# EAGLE design led_driver_12v_1a_round (EAGLE 7.5.0)
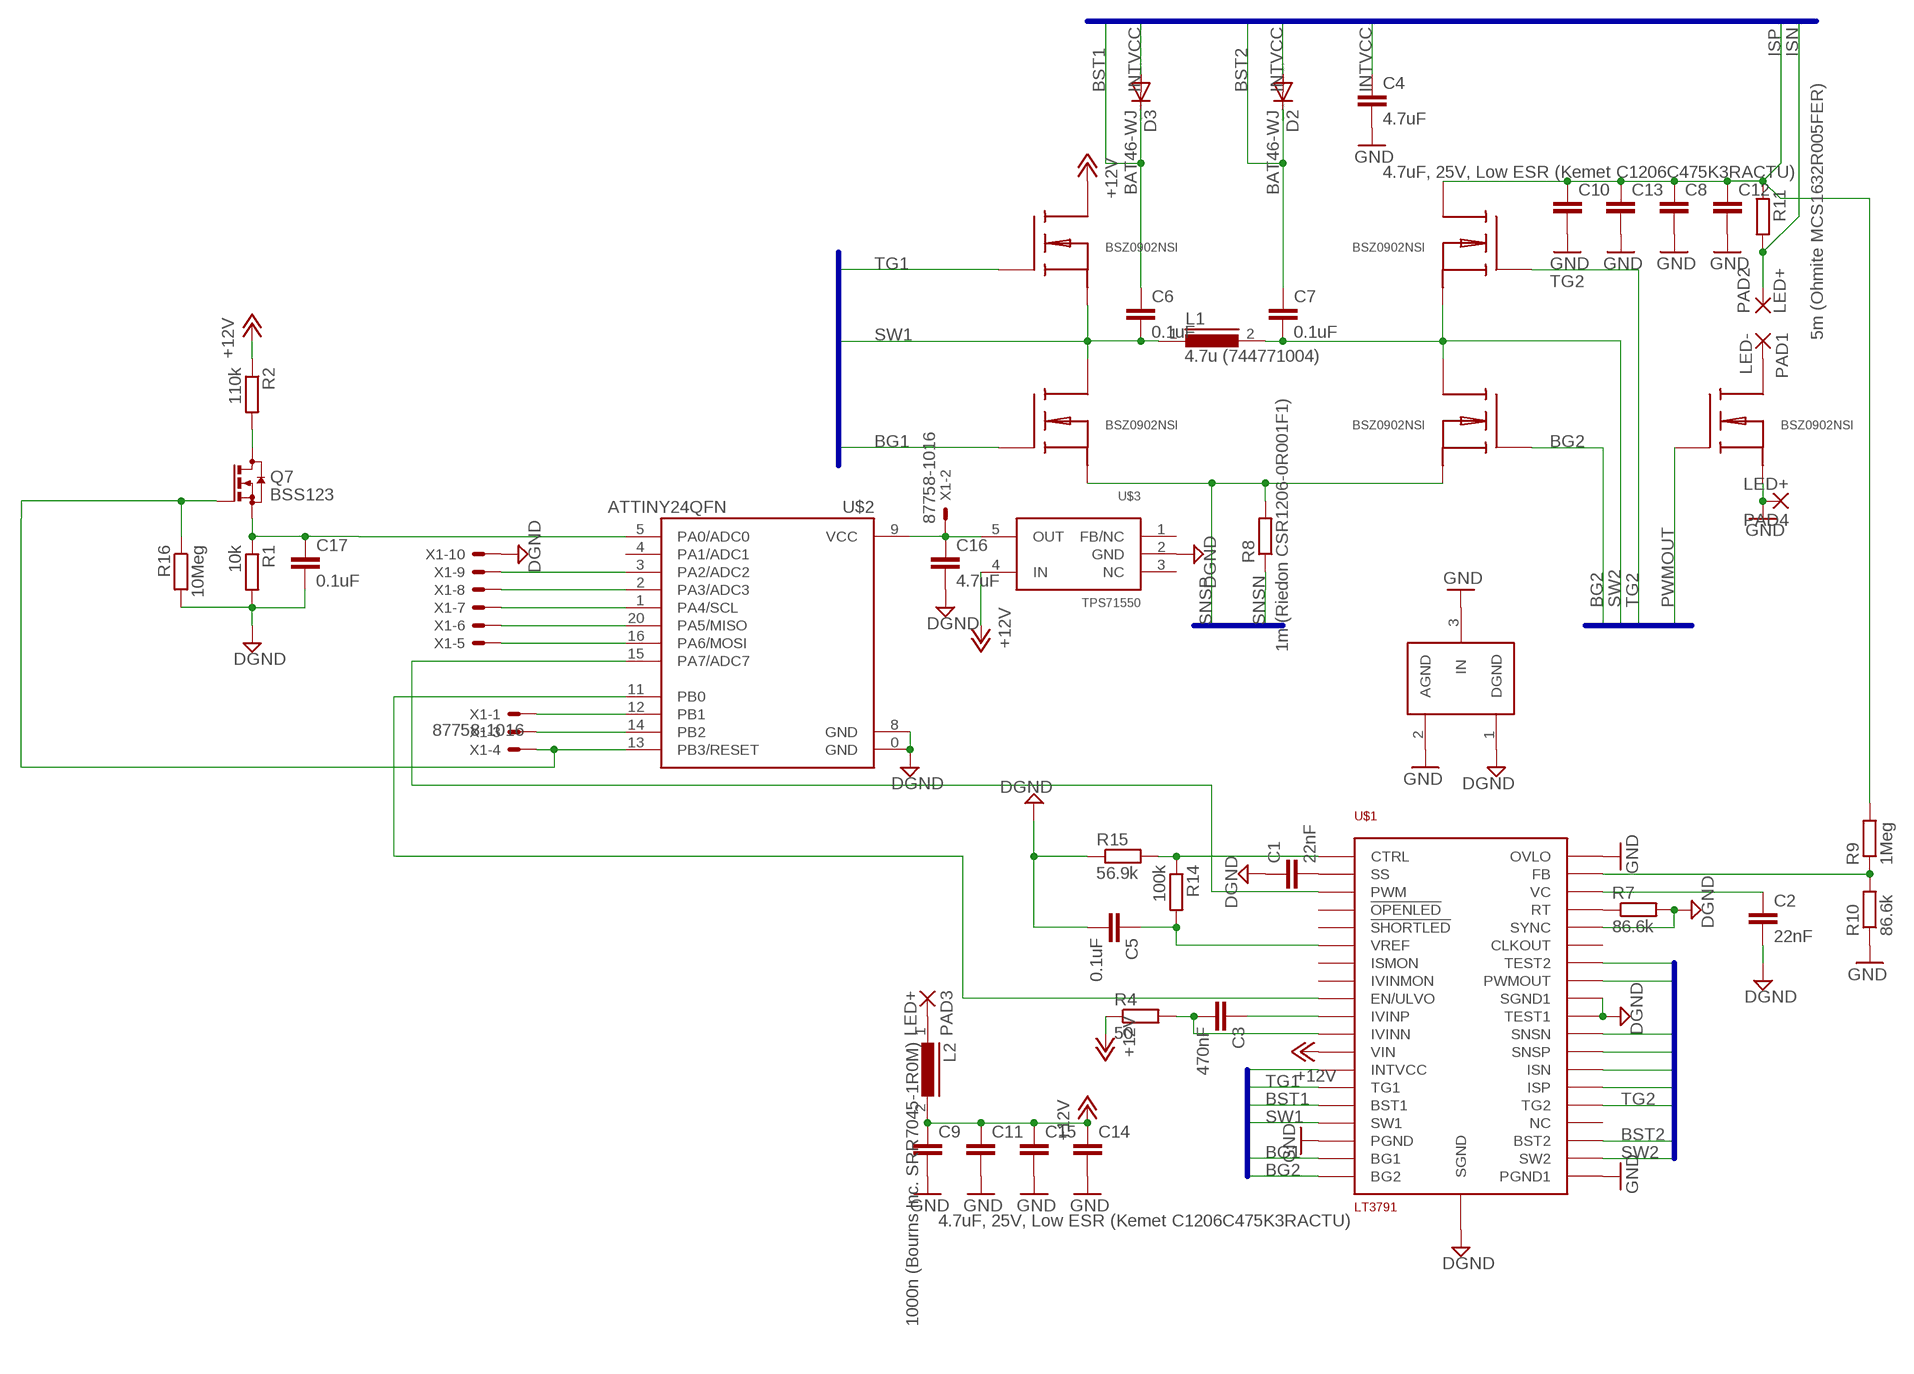
[diagram p0: schematic, sheet 1]

## Parts
C1  22nF  C-EUC0402  [C0402]
C2  22nF  C-EUC0402K  [C0402K]
C3  470nF  C-EUC0402K  [C0402K]
C4  4.7uF  C-EUC1206  [C1206]
C5  0.1uF  C-EUC0402K  [C0402K]
C6  0.1uF  C-EUC0402K  [C0402K]
C7  0.1uF  C-EUC0402K  [C0402K]
C8  4.7uF, 25V, Low ESR (Kemet C1206C475K3RACTU)  C-EUC1206  [C1206]
C9  4.7uF, 25V, Low ESR (Kemet C1206C475K3RACTU)  C-EUC1206  [C1206]
C10  4.7uF, 25V, Low ESR (Kemet C1206C475K3RACTU)  C-EUC1206  [C1206]
C11  4.7uF, 25V, Low ESR (Kemet C1206C475K3RACTU)  C-EUC1206  [C1206]
C12  4.7uF, 25V, Low ESR (Kemet C1206C475K3RACTU)  C-EUC1206  [C1206]
C13  4.7uF, 25V, Low ESR (Kemet C1206C475K3RACTU)  C-EUC1206  [C1206]
C14  4.7uF, 25V, Low ESR (Kemet C1206C475K3RACTU)  C-EUC1206  [C1206]
C15  4.7uF, 25V, Low ESR (Kemet C1206C475K3RACTU)  C-EUC1206  [C1206]
C16  4.7uF  C-EUC1206  [C1206]
C17  0.1uF  C-EUC0402K  [C0402K]
D2  BAT46-WJ  DIODE-SOD323-W  [SOD323-W]
D3  BAT46-WJ  DIODE-SOD323-W  [SOD323-W]
L1  4.7u (744771004)  DR127  [DR127]
L2  1000n (Bourns Inc. SRR7045-1R0M)  DR74  [DR74]
PAD1  LED-  WIREPAD3,81/1,4  [3,81/1,4]
PAD2  LED+  WIREPAD3,81/1,4  [3,81/1,4]
PAD3  LED+  WIREPADSMD5-2,5  [5-2,5]
PAD4  LED+  WIREPADSMD5-2,5  [5-2,5]
Q1  BSZ0902NSI  BSZ090X  [BSZ090X]
Q2  BSZ0902NSI  BSZ090X  [BSZ090X]
Q3  BSZ0902NSI  BSZ090X  [BSZ090X]
Q4  BSZ0902NSI  BSZ090X  [BSZ090X]
Q5  BSZ0902NSI  BSZ090X  [BSZ090X]
Q7  BSS123  [SOT23]
R1  10k  R-EU_R0402  [R0402]
R2  110k  R-EU_R0402  [R0402]
R4  50  R-EU_R0402  [R0402]
R7  86.6k  R-EU_R0402  [R0402]
R8  1m (Riedon CSR1206-0R001F1)  R-EU_R1206  [R1206]
R9  1Meg  R-EU_R0402  [R0402]
R10  86.6k  R-EU_R0402  [R0402]
R11  5m (Ohmite MCS1632R005FER)  R-EU_R1206  [R1206]
R14  100k  R-EU_R0402  [R0402]
R15  56.9k  R-EU_R0402  [R0402]
R16  10Meg  R-EU_R0402  [R0402]
U$1  LT3791  [TSSOP38]
U$2  ATTINY24QFN  [QFN20]
U$3  TPS71550  TPS715  [SC70]
U$4  GND_CONNECT  [GND_CONNECT]
X1  87758-1016  [87758-1016]

## Nets
+12V: C9.1 C11.1 C14.1 C15.1 L2.2 Q1.D Q1.D@1(D) Q1.D@2(D) Q1.D@3(D) Q1.D@4(D) R2.1 R4.1 U$1.P$12(VIN) U$3.4(IN)
BG1 [HI_PWR]: Q2.G U$1.P$18(BG1)
BG2 [HI_PWR]: Q3.G U$1.P$19(BG2)
BST1 [HI_PWR]: C6.1 D3.C U$1.P$15(BST1)
BST2 [HI_PWR]: C7.1 D2.C U$1.P$22(BST2)
DGND: C1.1 C2.2 C5.2 C16.2 C17.2 R1.2 R7.2 R15.1 R16.2 U$1.P$29(TEST1) U$1.P$30(SGND) U$1.P$34(SYNC) U$1.P$39(SGND1) U$2.0(GND) U$2.8(GND) U$3.2(GND) U$4.1(DGND) X1.10
GND [HI_PWR]: C4.2 C8.2 C9.2 C10.2 C11.2 C12.2 C13.2 C14.2 C15.2 PAD4.1(P) Q5.S@1(S) Q5.S@2(S) Q5.S@3(S) Q5.S@4(S) R10.1 U$1.P$17(PGND) U$1.P$20(PGND1) U$1.P$38(OVLO) U$4.2(AGND) U$4.3(IN)
INTVCC [HI_PWR]: C4.1 D2.A D3.A U$1.P$13(INTVCC) U$1.P$32(TEST2)
ISN: PAD2.1(P) R11.2 U$1.P$26(ISN)
ISP: C8.1 C10.1 C12.1 C13.1 Q4.D Q4.D@1(D) Q4.D@2(D) Q4.D@3(D) Q4.D@4(D) R9.2 R11.1 U$1.P$25(ISP)
MISO: U$2.20(PA5/MISO) X1.6
MOSI: U$2.16(PA6/MOSI) X1.5
N$1: C5.1 R14.2 U$1.P$6(VREF)
N$2: R14.1 R15.2 U$1.P$1(CTRL)
N$3: R7.1 U$1.P$35(RT)
N$4: C1.2 U$1.P$2(SS)
N$5: C2.1 U$1.P$36(VC)
N$6: R9.1 R10.2 U$1.P$37(FB)
N$7: C3.1 U$1.P$10(IVINP)
N$8: Q7.3(D) R2.2
N$9: C3.2 R4.2 U$1.P$11(IVINN)
N$10: U$1.P$9(EN/ULVO) U$2.11(PB0)
N$12: C16.1 U$2.9(VCC) U$3.5(OUT) X1.2
N$14: U$1.P$3(PWM) U$2.15(PA7/ADC7)
N$15: C17.1 Q7.2(S) R1.1 U$2.5(PA0/ADC0)
N$19: PAD1.1(P) Q5.D Q5.D@1(D) Q5.D@2(D) Q5.D@3(D) Q5.D@4(D)
N$21: L2.1 PAD3.1(P)
PA2: U$2.3(PA2/ADC2) X1.9
PA3: U$2.2(PA3/ADC3) X1.8
PB1: U$2.12(PB1) X1.1
PB2: U$2.14(PB2) X1.3
PWMOUT [HI_PWR]: Q5.G U$1.P$31(PWMOUT)
RESET: Q7.1(G) R16.1 U$2.13(PB3/RESET) X1.4
SCL: U$2.1(PA4/SCL) X1.7
SNSN: R8.1 U$1.P$28(SNSN)
SNSP: Q2.S@1(S) Q2.S@2(S) Q2.S@3(S) Q2.S@4(S) Q3.S@1(S) Q3.S@2(S) Q3.S@3(S) Q3.S@4(S) R8.2 U$1.P$27(SNSP)
SW1 [HI_PWR]: C6.2 L1.1 Q1.S@1(S) Q1.S@2(S) Q1.S@3(S) Q1.S@4(S) Q2.D Q2.D@1(D) Q2.D@2(D) Q2.D@3(D) Q2.D@4(D) U$1.P$16(SW1)
SW2 [HI_PWR]: C7.2 L1.2 Q3.D Q3.D@1(D) Q3.D@2(D) Q3.D@3(D) Q3.D@4(D) Q4.S@1(S) Q4.S@2(S) Q4.S@3(S) Q4.S@4(S) U$1.P$21(SW2)
TG1 [HI_PWR]: Q1.G U$1.P$14(TG1)
TG2 [HI_PWR]: Q4.G U$1.P$24(TG2)
Unconnected: U$1.P$4(!OPENLED) U$1.P$5(!SHORTLED) U$1.P$7(ISMON) U$1.P$8(IVINMON) U$1.P$23(NC) U$1.P$33(CLKOUT) U$2.4(PA1/ADC1) U$3.1(FB/NC) U$3.3(NC)

## Buses
BG1,BG2,SW1,SW2,TG1,TG2,BST1,BST2,INTVCC
BG1,BG2,SW1,SW2,TG1,TG2,BST1,BST2,INTVCC,PWMOUT,SNSP,SNSN,ISN,ISP

## Library data of the parts
C1-C3 C5-C7 C17 = resistor:C-EU: CAPACITOR, European symbol
C4 C8-C16 = rcl:C-EU: CAPACITOR, European symbol
D2 D3 = diode:DIODE-: DIODE
L1 = inductors:DR127: High Power Density, High Efficiency, Shielded Inductors Source: coiltronics_dr_series.pdf
L2 = inductors:DR74: High Power Density, High Efficiency, Shielded Inductors Source: coiltronics_dr_series.pdf
PAD1-PAD4 = wirepad:WIREPAD: Wire PAD connect wire on PCB
Q1-Q5 = vsd_custom:BSZ090X
Q7 = transistor-small-signal:BSS123: N-CHANNEL MOS FET
R1 R2 R4 R7-R11 R14-R16 = resistor:R-EU_: RESISTOR, European symbol
U$1 = ltc3791:LT3791
U$2 = SparkFun-DigitalIC:ATTINY24: Atmel 20-pin 2kB flash uC
U$3 = TPS715:TPS715
U$4 = SparkFun-Passives:GND_CONNECT: Use to make a connection of multiple grounds in only one place.
X1 = con-molex:87758-1016: 10 Pin - 2mm Dual Row Single Wafer, Vertical T/H HDR Source: http://www.molex.com/pdm_docs/sd/877580616_sd.pdf; MF: MOLEX; MPN: 87758-1016; OC_FARNELL: 7472340; OC_NEWARK: 59J1558

## Net classes
0 default: width 0.152 mm, clearance 0.152 mm
1 HI_PWR: width 0.3 mm, drill 0.4 mm, clearance 0.15 mm

## Board
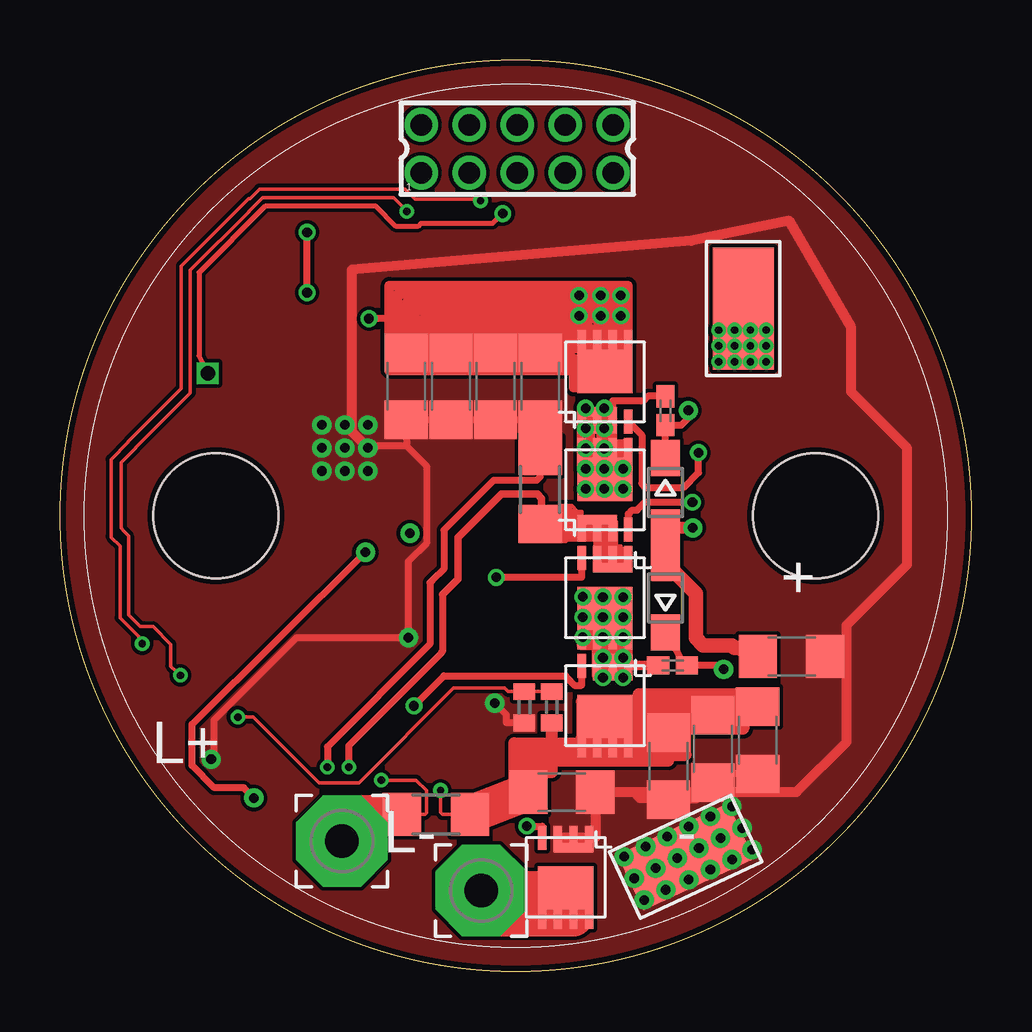
[diagram p1: board, top side]
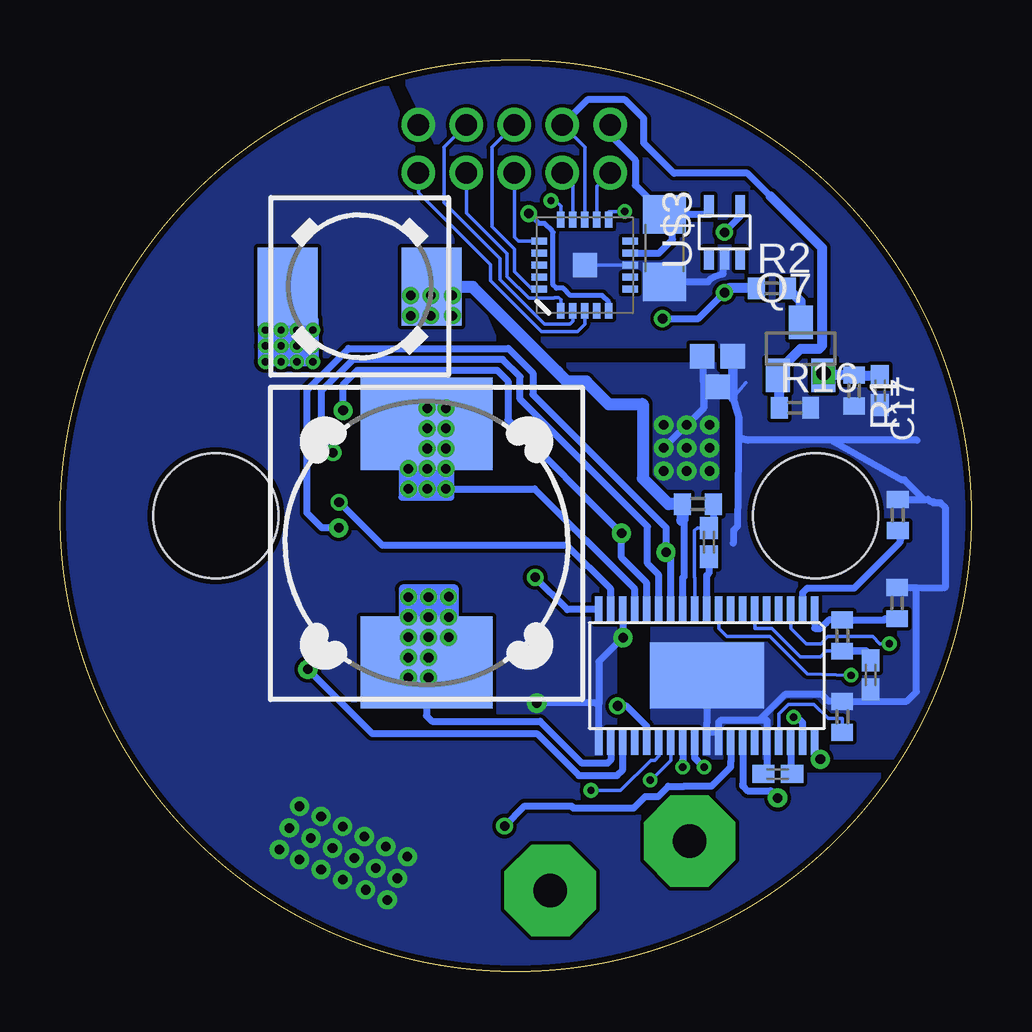
[diagram p2: board, bottom side, seen from below]

Size 38 x 38 mm. Coordinates in mm from the lower left corner, seen from the top.
Outline: circle at 19,19 radius 19
Copper layers (1*16): Top 0.035mm / dielectric 1.5mm / Bottom 0.035mm
Design rules "SeeedStudio_2layer_DRU_no_angle_20140221": minimum track width 6mil, minimum drill 12mil, track to track 6mil, track to pad 6mil, pad to pad 6mil, via to via 6mil, smd to smd 0mil, copper to edge 10mil, drill to drill 10mil, minimum pad ring 10mil, minimum via ring 6mil, stop-mask expansion 2mil, vias tented up to drill 100mil, thermal gap 10mil
Holes 5.2 mm at 31.5,19 6.5,19

### Footprints (pad centres in the part's own frame; a part is rotated, then mirrored left to right if it is on the bottom)
C0402 = smd 0.7 x 0.9: 1 -0.65,0; 2 0.65,0
C0402K = smd 0.925 x 0.74: 1 -0.6,0; 2 0.6,0
C1206 = smd 1.6 x 1.8: 1 -1.4,0; 2 1.4,0
SOD323-W = smd 1.5 x 1.2: A 1.45,0; C -1.45,0
DR127 = smd 3.85 x 5.5: 1 -4.975,0; 2 4.975,0
DR74 = smd 2.5 x 3.25: 1 -3,0; 2 3,0
3,81/1,4 = drill 1.397 pad 3.81 octagon: 1 0,0
5-2,5 = smd 2.54 x 5.08: 1 0,0
BSZ090X = smd 1.8 x 2.3: D 0.44,0 | smd 1 x 0.35: D@1 1.65,-0.975; D@2 1.65,-0.325; D@3 1.65,0.325; D@4 1.65,0.975; G -1.65,-0.975; S@2 -1.65,-0.325; S@3 -1.65,0.325; S@4 -1.65,0.975 | smd 0.4 x 1.65: S@1 -1.25,0.325
SOT23 = smd 1 x 1.4: 1 -0.95,-1.1; 2 0.95,-1.1; 3 0,1.1
R0402 = smd 0.7 x 0.9: 1 -0.65,0; 2 0.65,0
R1206 = smd 1.6 x 1.803: 1 -1.422,0; 2 1.422,0
TSSOP38 = smd 1.1 x 0.315: P$1 -2.75,4.5; P$2 -2.75,4; P$3 -2.75,3.5; P$4 -2.75,3; P$5 -2.75,2.5; P$6 -2.75,2; P$7 -2.75,1.5; P$8 -2.75,1; P$9 -2.75,0.5; P$10 -2.75,0; P$11 -2.75,-0.5; P$12 -2.75,-1; P$13 -2.75,-1.5; P$14 -2.75,-2; P$15 -2.75,-2.5; P$16 -2.75,-3; P$17 -2.75,-3.5; P$18 -2.75,-4; P$19 -2.75,-4.5; P$20 2.75,-4.5; P$21 2.75,-4; P$22 2.75,-3.5; P$23 2.75,-3; P$24 2.75,-2.5; P$25 2.75,-2; P$26 2.75,-1.5; P$27 2.75,-1; P$28 2.75,-0.5; P$29 2.75,0; P$30 2.75,0.5; P$31 2.75,1; P$32 2.75,1.5; P$33 2.75,2; P$34 2.75,2.5; P$35 2.75,3; P$36 2.75,3.5; P$37 2.75,4; P$38 2.75,4.5 | smd 2.75 x 4.75: P$39 0,0
QFN20 = smd 1 x 1: 0 0,0 | smd 0.65 x 0.3: 1 -1.9,1; 2 -1.9,0.5; 3 -1.9,0; 4 -1.9,-0.5; 5 -1.9,-1; 11 1.9,-1; 12 1.9,-0.5; 13 1.9,0; 14 1.9,0.5; 15 1.9,1 | smd 0.3 x 0.65: 6 -1,-1.9; 7 -0.5,-1.9; 8 0,-1.9; 9 0.5,-1.9; 10 1,-1.9; 16 1,1.9; 17 0.5,1.9; 18 0,1.9; 19 -0.5,1.9; 20 -1,1.9
SC70 = smd 0.9 x 0.4: 1 -1.1,0.65; 2 -1.1,0; 3 -1.1,-0.65; 4 1.1,-0.65; 5 1.1,0.65
GND_CONNECT = smd 1.016 x 1.016: 1 -1.016,0; 2 -1.016,-1.27; 3 0.254,-0.635
87758-1016 = drill 0.9 pad 1.27: 1 -4,-1; 2 -4,1; 3 -2,-1; 4 -2,1; 5 0,-1; 6 0,1; 7 2,-1; 8 2,1; 9 4,-1; 10 4,1

### Placement (x,y rotation side)
C1  3.08,19.03 270 bottom
C2  8.08,8.23 180 bottom
C3  10.95,17.89 90 bottom
C4  30.5,13.13 0 top
C5  4.21,12.37 270 bottom
C6  25.24,23.38 90 top
C7  25.54,12.76 180 top
C8  25.36,8.56 270 top
C9  14.44,24.4 270 top
C10  29.08,9.64 270 top
C11  16.3,24.4 270 top
C12  20.92,7.48 0 top
C13  27.22,9.28 270 top
C14  20.02,24.4 270 top
C15  18.16,24.4 270 top
C16  12.8,30.16 270 bottom
C17  3.82,24.22 270 bottom
D2  25.24,15.58 90 top
D3  25.24,19.96 270 top
L1  22.72,17.86 270 bottom
L2  25.51,28.56 0 bottom
PAD1  17.55,3.38 0 top
PAD2  11.76,5.44 0 top
PAD3  28.48,27.64 0 top
PAD4  26.08,4.78 115 top
Q1  22.72,24.58 90 top
Q2  22.72,20.08 90 top
Q3  22.72,15.58 270 top
Q4  22.72,11.08 270 top
Q5  21.08,3.92 270 top
Q7  7.12,25.96 0 bottom
R1  4.9,24.22 270 bottom
R2  8.32,28.48 0 bottom
R4  11.4,19.48 0 bottom
R7  5.39,10.62 90 bottom
R8  20.02,20.08 270 top
R9  20.5,11.02 270 top
R10  19.36,11.02 90 top
R11  15.67,6.55 180 top
R14  5.39,14.01 270 bottom
R15  3.1,15.36 270 bottom
R16  7.36,23.5 0 bottom
U$1  11.04,12.34 270 bottom
U$2  16.12,29.45 90 bottom
U$3  10.3,30.82 90 bottom
U$4  9.96,24.62 270 bottom
X1  19.06,34.3 0 top

### Tracks (layer width: path | path; a pad name or v marks a point on that pad's centre or on a via)
+12V  (via drill 0.4, 0.4 pad 0.61)
  Top 0.152: 22.76,25.5 23.05,25.5 Q1.D@2 23.05,26.59 | 22.39,25.87 22.76,25.5 | Q1.D 22.76,25.06 22.76,25.5 | 21.75,25.87 21.75,25.5 | Q1.D@4 21.75,25.87 | 21.75,25.87 22.39,25.87 | Q1.D@3 22.39,25.87 | C11.1 C9.1
  Top 0.3: 13.72,28.6 13.72,27.22 v12.88,27.22 | v10.3,28.3 v10.3,30.82
  Top 0.4: C14.1 21.15,25.8 21.45,25.5 21.75,25.5 | 23.05,26.59 23.33,26.59 21.94,26.74 21.94,26.5 15.4,26.5 15.4,26.86 22.06,26.86 22.06,26.26 15.16,26.26 15.16,27.22 22.42,27.22 22.42,27.04 | 22.42,27.04 22.42,25.96 14.8,25.96 14.8,27.58 22.72,27.58 22.72,25.54 14.44,25.54 14.44,27.88 23.08,27.88 | 23.08,27.88 23.08,25.18 14.08,25.18 14.08,28.24 23.38,28.24 | 23.38,28.24 v23.38,28.18 | v23.38,28.18 v23.38,27.34 | v23.38,27.34 23.38,24.34 21.4,24.34 21.4,25.06 13.72,25.06 13.72,27.22 13.72,28.6 23.68,28.6 23.68,26.23 Q1.D@1 | 23.38,28.24 v23.38,28.18 | 23.08,27.88 v23.38,27.34 | v22.54,27.34 22.42,27.04
  Top 0.406: C14.1 C15.1 C11.1 19.86,25.8 v21.64,27.34
  Bottom 0.3: 12.05,18.81 11.99,18.74 11.99,16.46 12.04,16.41 U$1.P$12 | U$3.4 9.65,31.47 v10.3,30.82 | v12.88,27.22 11.38,27.22 v10.3,28.3
  Bottom 0.4: 21.46,28.48 v21.64,28.18 | L2.2 v22.54,28.18
  Bottom 0.406: L2.2 22.48,28.54 21.52,28.54 21.46,28.48 v21.64,27.34 | R2.1 10.12,28.48 v10.3,28.3
  Bottom 0.5: 13.71,23.66 13.75,23.66 | 13.75,23.66 15.13,23.66 16.07,24.6 16.86,24.6 17.26,25 20.8,28.54 21.52,28.54 | 13.75,23.66 13.71,23.66 | 13.71,23.66 13.71,20.56 12.63,19.48 R4.1 12.05,18.81
BG1  (via drill 0.4 pad 0.61)
  Top 0.3: Q2.G 23.7,19.08 23.85,19.23 24.06,19.23 24.39,19.56 v26.36,19.56
  Bottom 0.3: v26.36,19.56 24.56,17.76 16.86,17.76 15.04,15.94 U$1.P$18
BG2  (via drill 0.4 pad 0.61)
  Top 0.3: v18.19,16.43 21.75,16.43 Q3.G
  Bottom 0.3: U$1.P$19 16.85,15.09 v18.19,16.43
BST1  (via drill 0.4 pad 0.8)
  Top 0.3: 25.57,22.78 25.9,22.78 26.2,23.07 v26.2,23.39 | D3.C 25.24,22.46 25.25,22.46 25.57,22.78 | C6.1 25.57,22.78
  Bottom 0.3: U$1.P$15 13.54,16.2 14.59,17.25 v14.59,18.27 19.33,23.01 19.33,24.62 19.78,25.07 25.6,25.07 26.2,24.46 v26.2,23.39
BST2  (via drill 0.4 pad 0.8)
  Top 0.3: v27.66,12.6 27.5,12.64 27.38,12.76 C7.1 26.02,12.82 25.42,13.9 D2.C
  Bottom 0.3: v27.66,12.6 24.98,9.92 18.12,9.92 16.37,8.17 14.78,8.17 14.54,8.41 U$1.P$22
DGND
  Bottom 0.152: U$2.0 15.4,29.45 14.78,29.45 U$2.8 | 9.32,22.15 5.89,22.17 | 9.4,24.54 9.4,24.56 9.95,23.9 | C2.2 8.68,8.29 8.54,8.44 | U$1.P$29 11.04,9.98 | U$1.P$30 10.54,9.98
  Bottom 0.27: 10.72,28.96 10.36,29.08
  Bottom 0.3: 5.89,22.17 2.9,20.5 2.8,20.5 1.96,19.66 C1.1 1.81,19.68 1.77,19.64 1.59,19.58 1.6,19.54 1.3,19.54 1.08,19.32 1.08,18.95 1.08,16.09 1.08,16.04 1.12,16 2.3,16.01 | 2.27,22.15 9.32,22.15 | 2.3,16.01 2.3,11.66 2.7,11.27 R7.2 5.95,11.27 6.25,11.57 7.76,11.57 8.84,10.49 8.54,10.49 | 8.54,8.44 U$1.P$34 8.54,10.49 | 8.54,10.49 10.45,10.49 10.54,10.4 10.54,9.98 11.04,9.98 11.04,10.37 U$1.P$39 | 9.94,17.86 9.91,17.89 9.91,18.41 9.77,18.55 9.71,23.08 9.95,23.9 | R15.1 2.3,16.01 | C16.2 10.98,28.75 10.84,28.9 10.72,28.96 | 10.36,29.08 U$3.2
  Bottom 0.305: 9.32,22.15 9.69,22.24 9.71,23.08
  Bottom 0.4: U$4.1 9.95,23.9
  pour Bottom (no thermals): -3.26,8.98 13.24,8.98 13.24,18.94 9.64,18.94 9.64,26.14 18.16,26.14 25.06,40.24 -3.26,39.76
GND  (via drill 0.4 pad 0.8)
  Top 0.3: 14.44,21.9 15.3,21.04 15.3,17.87 14.53,17.11 v14.53,13.92 9.86,13.92 6.42,10.48 6.42,8.94 6.34,8.86 v6.3,8.85 | R10.1 | R10.1 19.36,10.35 | v18.12,11.19 18.61,10.7 18.61,10.37 R10.1 | 14.44,21.9 13.09,21.9 v12.84,21.83 | 14.44,22.45 14.55,22.45 15.1,23 C11.2 C15.2 C14.2 | 14.44,22.45 14.44,21.9 | C9.2 14.44,22.45 | C12.2 23.84,7.48 24.16,7.16 C8.2 25.96,7.16 | 25.96,7.16 26.08,7.04 PAD4.1 | 25.96,7.16 26.56,7.16 26.56,7.22 C13.2 27.52,7.88 27.88,8.24 C10.2 | Q5.S@3 Q5.S@1
  Top 0.406: Q5.S@2 Q5.S@3 Q5.S@4 22.32,5.58 C12.2 30.7,7.48 32.8,9.58 32.8,12.88 | 32.8,12.88 32.8,14.44 35.32,16.96 35.32,21.82 32.98,24.16 32.98,26.86 30.4,31.3 26.32,30.46 12.16,29.26 12.16,22.5 v12.84,21.83 | C4.2 32.8,12.83 32.8,12.88
  Bottom 0.3: v14.54,13.92 15.54,12.92 15.54,11.15 | v14.54,13.92 14.54,14.24 U$1.P$17 | v14.54,13.92 v14.53,13.92 | 15.54,11.15 15.69,11.19 v18.12,11.19 | 11.16,23.5 12.24,22.42 v12.84,21.83 | 11.16,23.5 11.16,24.23 10.67,24.43 10.57,24.47 | U$4.2 11.16,23.5 | U$1.P$38 6.54,8.96 v6.3,8.85 | U$1.P$20 15.54,11.15
  Bottom 0.305: U$4.3 10.61,24.37 10.67,24.43
  other vias: 11.88,21.83 10.92,21.83 10.92,20.87 11.88,20.87 12.84,20.87 12.84,22.79 11.88,22.79 10.92,22.79 23.52,4.79 24.42,5.21 25.32,5.63 26.22,6.05 27.12,6.47 28.02,6.89 23.94,3.89 24.36,2.99 24.84,4.31 25.26,3.41 25.74,4.73 26.64,5.15 27.54,5.57 28.44,5.99 28.86,5.09 28.02,4.67 27.12,4.25 26.22,3.83
  pour Bottom (no thermals): -3.26,8.14 14.92,8.14 14.92,19.84 10.66,19.84 10.66,25.24 19.42,25.24 25.48,39.34 43.24,39.82 43.24,-0.32 28.24,-0.32 28.24,-1.76 -3.26,-1.76
  pour Top (no thermals): -3.02,40.48 41.62,40.48 41.62,-3.98 -3.02,-3.98
INTVCC  (via drill 0.4 pad 0.8)
  Top 0.3: v8.08,7.24 7.66,7.66 6.44,7.66 5.5,8.59 5.5,10.31 v12.74,17.48 | 26.09,18.49 25.96,18.51 | D3.A D2.A
  Top 0.5: D3.A 25.96,18.51 | v26.38,18.49 26.09,18.49
  Top 0.61: C4.1 28.71,13.13 28.36,13.48 28.12,13.48 28,13.6 26.8,13.6 26.5,13.9 26.5,15.77 D2.A
  Bottom 0.3: v26.38,18.49 27.07,18.49 27.7,19.12 27.7,19.39 27.7,24.25 25.97,25.97 19.31,25.97 18.29,24.95 18.29,24.05 12.74,18.5 v12.74,17.48 12.54,17.34 12.54,15.94 U$1.P$13 | U$1.P$32 9.54,7.82 9.54,7.74 9.34,7.54 8.38,7.54 v8.08,7.24
ISN  (via drill 0.3 pad 0.61)
  Top 0.152: R11.2 15.21,6.55 15.28,6.61 15.28,7.55 14.85,7.97 v13.39,7.97
  Top 0.3: 12.63,6.55 PAD2.1
  Top 1.6: R11.2 12.63,6.55
  Bottom 0.152: v13.39,7.97 13.37,7.97 12.54,8.81 U$1.P$26
ISP  (via drill 0.3 pad 0.61)
  Top 0.152: R11.1 15.95,6.55 15.87,6.63 v15.87,7.55 | R9.2 20.5,10.66 | 27.21,10.68 C13.1 | C8.1 26.08,9.96 26.49,9.96
  Top 0.5: C12.1 18.94,7.48 18.94,9.52 21.75,9.52 Q4.D@1 21.76,9.43 | 21.76,9.43 21.76,9.76 23.7,9.76 Q4.D@4 | Q4.D@4 Q4.D@3 | Q4.D@3 Q4.D@2 | Q4.D@2 21.76,9.43 | 21.76,9.43 19.18,9.43 19.18,8.32 19.6,8.32 19.6,9.04 21.76,9.04 | 21.76,9.04 23.98,9.04 | 23.98,9.04 26.08,9.04 26.08,9.96 | Q4.D@3 Q4.D@4 | Q4.D@4 24.46,9.43 24.46,10.54 24.11,10.54 | 24.11,10.54 Q4.D@4 | 24.11,10.54 23.98,10.54 23.98,9.04 | 23.98,9.04 21.76,9.04 | 21.76,9.04 20.08,9.04 20.08,8.32 20.5,8.32 R9.2 | Q4.D 24.11,10.64 | 24.11,10.64 24.11,10.54 | 21.76,9.43 Q4.D@2 | C10.1 28.36,11.04 28.36,11.56 26.26,11.56 | 26.26,11.56 24.11,11.56 24.11,10.64 | 27.21,10.68 28.18,10.68 | 28.18,10.68 28.48,10.68 28.48,10.12 26.26,10.12 26.26,10.9 | 26.26,11.56 24.16,11.56 24.16,10.72 26.2,10.72 26.2,11.44 24.52,11.44 24.52,10.78 25.84,10.78 25.84,11.26 21.76,11.26 21.76,9.04 | 21.76,9.04 20.74,9.04 20.74,8.8 25.36,8.8 25.36,10.18 28.18,10.18 28.18,10.68
  Top 1.6: R11.1 C12.1
  Bottom 0.152: U$1.P$25 13.04,8.98 13.21,8.81 13.37,8.81 14.63,7.55 v15.87,7.55
MISO
  Bottom 0.152: X1.6 20,34.36 20,31.05 19.05,30.11 19.05,29.17 18.33,28.45 U$2.20
MOSI
  Bottom 0.152: U$2.16 18.88,30.45 19.06,30.62 19.06,32.82 X1.5
N$1
  Bottom 0.152: U$1.P$6 9.04,14.7 9.04,14.31 8.32,14.31 7.13,13.12 6.3,13.12 6.07,13.36 R14.2
  Bottom 0.305: R14.2 4.42,13.36 4,12.94 4.19,12.94 C5.1
N$2
  Bottom 0.3: U$1.P$1 6.54,14.31 6.28,14.31 6.07,14.52 5.95,14.65 R14.1 3.65,14.65 3.6,14.71 R15.2
N$3
  Bottom 0.152: U$1.P$35 8.04,10.37 8.04,10.74 7.63,11.14 6.57,11.14 5.97,10.54 5.39,10.54 R7.1
N$4
  Bottom 0.3: C1.2 3.04,18.34 2.92,18.16 3.02,17.86 4.89,15.99 6.85,15.99 7.04,15.8 U$1.P$2
N$5
  Bottom 0.152: C2.1 7.48,8.35 7.54,8.41
  Bottom 0.3: U$1.P$36 7.54,8.41
N$6  (via drill 0.3 pad 0.61)
  Top 0.152: v7.41,10.61 8.06,10.61 10.81,7.86 12.46,7.86 16.42,11.82 18.53,11.82 18.68,11.67 R10.2 R9.1
  Bottom 0.152: 7.28,10.61 v7.41,10.61
  Bottom 0.3: 7.28,10.61 7.04,10.37 U$1.P$37
N$7
  Bottom 0.3: C3.1 10.95,16.6 11.04,16.52 U$1.P$10
N$8
  Bottom 0.406: Q7.3 7.12,27.93 R2.2
N$9
  Bottom 0.152: U$1.P$11 11.54,16.41 11.55,16.42 11.55,18.38 11.43,18.5 C3.2 10.95,18.61 10.76,18.81
  Bottom 0.3: R4.2 10.76,18.81
N$10  (via drill 0.3 pad 0.61)
  Top 0.152: v14.45,31.69 14.44,31.72 13.9,32.26 8.44,32.26 7.87,31.69 7.88,31.69 5.43,29.24 5.43,24.12 3.15,21.84 3.15,21.82 2.55,21.23 2.55,18.48 2.68,18.34 2.86,18.16 2.86,14.86 3.34,14.38 3.88,14.38 4.62,13.64 4.62,12.72 | 4.62,12.72 4.62,12.76 4.62,12.72 | 4.62,12.72 v5.02,12.35
  Bottom 0.152: v14.45,31.69 15.12,31.69 U$2.11 | v14.45,31.69 | v5.02,12.35 6.84,12.41 8.41,13.97 10.2,13.97 10.54,14.31 U$1.P$9
N$12
  Bottom 0.3: U$3.5 10.88,31.56 C16.1 | U$2.9 13.57,29.95 13.04,29.95 12.46,30.52 12.46,31 12.34,31.12 C16.1 | X1.2 15.06,34.86 14.02,33.82 14.02,32.77 C16.1
N$14  (via drill 0.3 pad 0.61)
  Top 0.152: v17.53,32.14 17.44,32.22 17.44,32.14 17.38,32.2 14.8,32.2 14.38,32.62 8.32,32.62 7.92,32.22 7.87,32.22 5.06,29.41 5.06,24.3 2.84,22.09 2.84,22.07 2.13,21.35 2.13,18.14 2.14,18.1 2.5,17.74 2.5,14.74 3.28,13.96 v3.42,13.66
  Bottom 0.152: v17.53,32.14 17.36,32.14 17.12,31.9 U$2.15 | v3.42,13.66 3.82,13.66 4.12,13.96 5.98,13.96 6.28,13.66 6.89,13.66 7.54,14.31 U$1.P$3
N$15  (via drill 0.4, 0.6)
  Top 0.2: v18.46,31.6 18.04,31.18 15.04,31.18 14.92,31.06 14.02,31.06 13.18,31.9 8.56,31.9 5.8,29.14 5.8,25.66 v6.16,24.94
  Bottom 0.2: U$2.5 15.12,27.91 15.4,28.18 16.72,28.18 17.02,28.48 17.31,28.48 17.44,28.61 17.44,30.82 17.5,30.88 17.8,31.18 18.04,31.18 v18.46,31.6 | v6.16,24.94 6.04,24.99 Q7.2
  Bottom 0.406: Q7.2 R1.1 4.9,24.82 C17.1
N$19
  Top 0.152: Q5.D@4 Q5.D@3
  Top 1.6: PAD1.1 21.08,3.38 | 21.08,3.38 Q5.D | 21.08,3.38 17.68,3.38 17.68,2.26 Q5.D@3 Q5.D@2 Q5.D@1
N$21  (via drill 0.3 pad 0.61)
  Top 0.4: PAD3.1 v27.46,25.42
  Bottom 0.152: 27.53,28.12 27.51,28.26 L2.1
  Bottom 0.4: 27.53,28.12 28.48,26.56 28.48,26.02 | 28.48,26.02 28.12,26.02 | 28.12,26.02 v28.12,26.74 | v28.12,26.74 | v28.12,26.74 28.18,26.74 | 28.18,26.74 28.72,26.74 | 28.72,26.74 v28.78,26.74 | v28.78,26.74 28.84,26.74 28.84,25.72 27.76,25.72 | 27.76,25.72 27.76,26.98 | 27.76,26.98 29.2,26.98 | 29.2,26.98 29.2,25.48 27.4,25.48 27.4,27.16 29.56,27.16 29.56,25.42 v29.44,25.42 | v29.44,25.42 | v29.44,25.42 v28.78,25.42 | v28.78,25.42 | v28.78,25.42 v28.12,25.42 | v28.12,25.42 | v28.12,25.42 v27.46,25.42 | 27.76,26.98 v27.46,26.74 | v28.12,26.74 28.18,26.74 | v28.78,26.74 28.72,26.74 | 29.2,26.98 v29.44,26.74 v29.44,26.08 | v29.44,25.42 | v28.78,25.42 | v28.12,25.42 | 27.76,25.72 v27.46,26.08 | 28.12,26.02 v28.12,26.08 | 28.48,26.02 v28.78,26.08
PA2
  Bottom 0.152: X1.9 23.06,32.46 20.06,29.46 20.06,28.81 17.94,26.69 16.43,26.69 16.12,26.99 U$2.3
PA3
  Bottom 0.152: U$2.2 16.62,27.11 16.74,26.99 17.81,26.99 19.66,28.85 19.66,29.71 22,32.05 22,34.36 X1.8
PB1
  Bottom 0.152: X1.1 15.62,32.73 U$2.12
PB2
  Bottom 0.152: X1.3 16.62,32.86 16.62,31.9 U$2.14
PWMOUT  (via drill 0.4 pad 0.61)
  Top 0.3: v19.47,6.06 20.1,6.06 Q5.G
  Bottom 0.3: v19.47,6.06 18.63,6.9 16.68,6.9 16.6,6.82 14.08,6.82 13.6,7.3 13.06,7.3 12.64,7.72 11.98,7.72 11.94,7.74 10.83,7.74 10.04,8.53 10.04,8.74 U$1.P$31
RESET
  Bottom 0.152: U$2.13 16.12,34.37 X1.4
  Bottom 0.3: 8.38,32.32 9.34,33.28 12.4,33.28 13.66,34.54 13.66,35.56 14.44,36.34 16.02,36.34 X1.4
  Bottom 0.406: R16.1 8.01,24.8 Q7.1 8.07,25.01 7.12,25.96 6.35,25.96 6.22,26.09 6.22,30.16 8.38,32.32
SCL
  Bottom 0.152: U$2.1 17.12,28.01 17.21,28.1 17.38,28.1 17.41,28.06 18.45,28.06 19.36,28.97 19.36,29.92 20.92,31.48 21.06,31.62 X1.7
SNSN  (via drill 0.3 pad 0.61)
  Top 0.3: R8.1 20.02,20.62 19.87,20.47 19.69,20.47 18.07,20.47 16,18.4 16,16.78 15.52,16.3 15.43,16.21 15.43,13.65 11.15,9.37 v11.15,8.52
  Bottom 0.3: U$1.P$28 11.54,8.9 11.44,8.81 v11.15,8.52
SNSP  (via drill 0.3 pad 0.61)
  Top 0.152: 15.96,13.38 15.94,13.37 | R8.2 21.15,18.66 21.15,18.84 21.47,18.98 20.92,18.98 20.92,19.42 21.34,19.42 21.58,19.18 | 21.58,19.18 21.76,19.18 21.76,18.82 21.7,18.82 21.7,19.06 21.75,18.98 Q2.S@4 21.75,18.79 22.23,18.56 22.34,18.68 Q2.S@1 22.39,18.79 | 21.58,19.18 21.58,18.1 21.52,18.1 21.52,19.24 21.4,19.24 21.4,18.1 21.28,18.1 21.28,19.3 21.16,19.3 21.16,18.04 21.04,18.04 21.04,19.3 20.92,19.3 20.92,17.92 21.1,17.92 21.1,17.98 21.58,17.98 21.58,19.18 | Q2.S@2 22.98,18.86 22.7,18.86 22.39,18.79 | 22.39,18.79 Q2.S@3 22.39,17.7 22.39,17.64 | 23.05,17.64 Q3.S@1 Q3.S@3 | 22.39,17.64 Q3.S@2 22.39,17.64 | 22.39,17.64 23.05,17.64 | Q3.S@4 23.64,17.64 23.44,17.64 23.44,17.02 22.6,17.02 22.6,17.56 23.32,17.56 23.32,17.14 22.72,17.14 22.72,17.5 23.2,17.5 23.2,17.2 22.84,17.2 22.84,17.56 23.38,17.56 23.38,17.74 22.3,17.74 22.3,17.68 22.3,17.98 21.94,17.98 21.94,18.76 23.2,18.76 23.2,17.8 22.48,17.8 22.48,18.04 22.06,18.04 22.06,18.64 23.08,18.64 23.08,17.86 22.54,17.86 22.54,18.04 22.18,18.04 22.18,18.52 22.84,18.52 22.84,17.92 22.6,17.92 22.6,18.46 22.72,18.46 22.72,17.98 22.96,17.98 22.96,17.5 23.32,17.5 23.32,17.62 23.05,17.64
  Top 0.3: 15.96,15.72 15.96,13.38 | 15.94,13.37 15.87,13.25 12.04,9.41 v12.04,8.53
  Top 0.305: 20.08,18.66 20.08,19.6 20.08,19.72 19.9,19.9 18.4,19.9 16.6,18.1 16.6,16.37 15.96,15.72
  Top 0.406: R8.2 20.08,18.66
  Bottom 0.152: v12.04,8.53
  Bottom 0.3: v12.04,8.53 12.04,8.81 U$1.P$27
SW1  (via drill 0.4 pad 0.61)
  Top 0.3: C6.2 24.51,23.98 24.32,23.79 23.05,23.79 Q1.S@2 23.05,22.66 | Q1.S@4 21.75,23.37 22.05,23.37 22.39,23.38 Q1.S@1 22.39,23.13 Q1.S@3 22.67,22.66 23.05,22.66 | Q2.D@2 23.26,21.94 23.26,21.4 23.44,21.4 23.44,21.76 23.32,21.76 23.32,20.62 22.78,20.62 22.78,23.2 22.48,23.2 22.48,20.98 22.18,20.98 22.18,23.08 22,23.08 22,20.98 21.7,20.98 21.7,23.38 23.08,23.38 23.08,22.06 23.5,22.06 23.5,21.73 Q2.D@1 | Q2.D@3 Q2.D@2 | Q2.D@4 Q2.D@3 | 23.05,22.66 23.05,22.13 Q2.D@2 | v21.91,20.12 21.96,20.92 22.01,21.66 22.23,21.72 Q2.D 22.39,20.84 22.39,21.33 Q2.D@3
  Top 0.4: v22.69,20.12 Q2.D | v22.69,20.96 22.48,20.98 | v23.47,20.96 21.82,20.8 v21.91,20.96 21.96,20.92 | Q2.D@3 v22.69,21.8 | 22.01,21.66 v21.91,21.8 | v21.91,22.64 Q1.S@4 | 22.67,22.66 v22.69,22.64 | 22.78,23.2 v22.69,23.48 | 22.05,23.37 v21.91,23.48
  Bottom 0.3: U$1.P$16 14.04,15.94 18.22,20.12 v21.91,20.12 22.42,20.02 22.42,20.26 23.14,20.26 23.14,20.44 22.12,20.44 22.12,20.14 23.32,20.14 23.32,20.62 21.94,20.62 21.94,19.9 23.56,19.9 23.56,20.8 21.7,20.8 21.7,19.78 23.74,19.78 23.74,21.04 21.7,21.04 21.7,20.25 22.7,20.25 22.72,20.61 L1.1
  Bottom 0.4: 23.32,20.14 v23.47,20.12
SW2  (via drill 0.4, 0.4 pad 0.61)
  Top 0.3: Q3.D 23.15,15.26 23.21,15.23 v21.8,15.62 | Q4.S@3 Q4.S@1 23.5,12.33 23.7,12.53 Q4.S@4
  Top 0.4: C7.2 23.7,12.76 Q4.S@4 v23.48,13.09 | v23.48,13.93 Q3.D@4 v23.48,13.93 | v23.48,13.93 Q3.D@3 | Q3.D@3 v22.64,13.93 | v22.64,13.93 Q3.D@2 | Q3.D@2 22.36,13.93 22.36,12.34 22.72,12.34 | 22.72,12.34 L1.2 | L1.2 22.72,14.56 | 22.72,14.56 23.05,14.56 Q3.D@3 | Q3.D@3 Q4.S@3 | 22.72,14.56 23.38,14.56 23.38,12.4 23.68,12.4 23.68,14.68 22.84,14.68 | 22.84,14.68 22.06,14.68 22.12,13.6 21.75,13.6 Q3.D@1 v21.8,13.93 | v22.64,15.61 22.84,12.73 22.84,14.68 | Q4.S@2 22.72,12.73 L1.2 | Q3.D@3 v22.64,13.93 | v22.64,13.93 Q3.D@2 | 22.72,12.34 v22.64,12.25 | 23.5,12.33 v23.48,12.25 | v22.64,13.09 L1.2 | v22.64,13.93 Q3.D@2
  Bottom 0.3: U$1.P$21 15.04,8.82 15.17,8.68 16.24,8.68 17.99,10.43 22.49,10.43 22.72,10.66 L1.2
  Bottom 0.4: 23.44,14.8 23.44,14.68 23.68,14.68 23.68,15.94 21.58,15.94 21.58,12.88 L1.2 22.39,12.88 v22.64,15.61 | 23.44,14.8 23.44,15.58 | 23.44,15.58 23.44,15.76 23.2,15.76 | 23.2,15.76 21.82,15.76 21.82,14.8 v21.8,14.77 | v21.8,15.62 22.9,15.62 22.9,14.56 | 22.9,14.56 23.2,14.56 23.2,15.76 | 22.9,14.56 22.6,14.56 22.6,15.52 22.18,15.52 22.18,14.74 22.42,14.74 | 22.42,14.74 22.42,15.64 22.06,15.64 | v22.64,14.77 22.42,14.74 | v23.48,15.61 23.44,15.58 | v23.48,14.77 23.44,14.8
TG1  (via drill 0.4 pad 0.61)
  Top 0.3: Q1.G 24.25,22.37 24.25,20.34 24.41,20.19 26.01,20.19 26.62,20.8 v26.62,21.63
  Bottom 0.3: v26.62,21.63 27.11,22.12 27.11,24.2 25.79,25.52 19.55,25.52 18.82,24.8 18.82,23.86 13.51,18.55 13.51,17 13.04,16.53 13.04,15.94 U$1.P$14
TG2  (via drill 0.4 pad 0.61)
  Top 0.3: v14.75,11.07 16.01,12.33 21.07,12.33 21.27,12.13 21.27,12.11 21.45,11.93 21.75,11.93 Q4.G
  Bottom 0.3: U$1.P$24 13.54,10.22 14.38,11.07 v14.75,11.07

### Text on the board
tNames: + | L+ | L- | -